# EAGLE design basic-thermometer-SD (EAGLE 7.2.0)
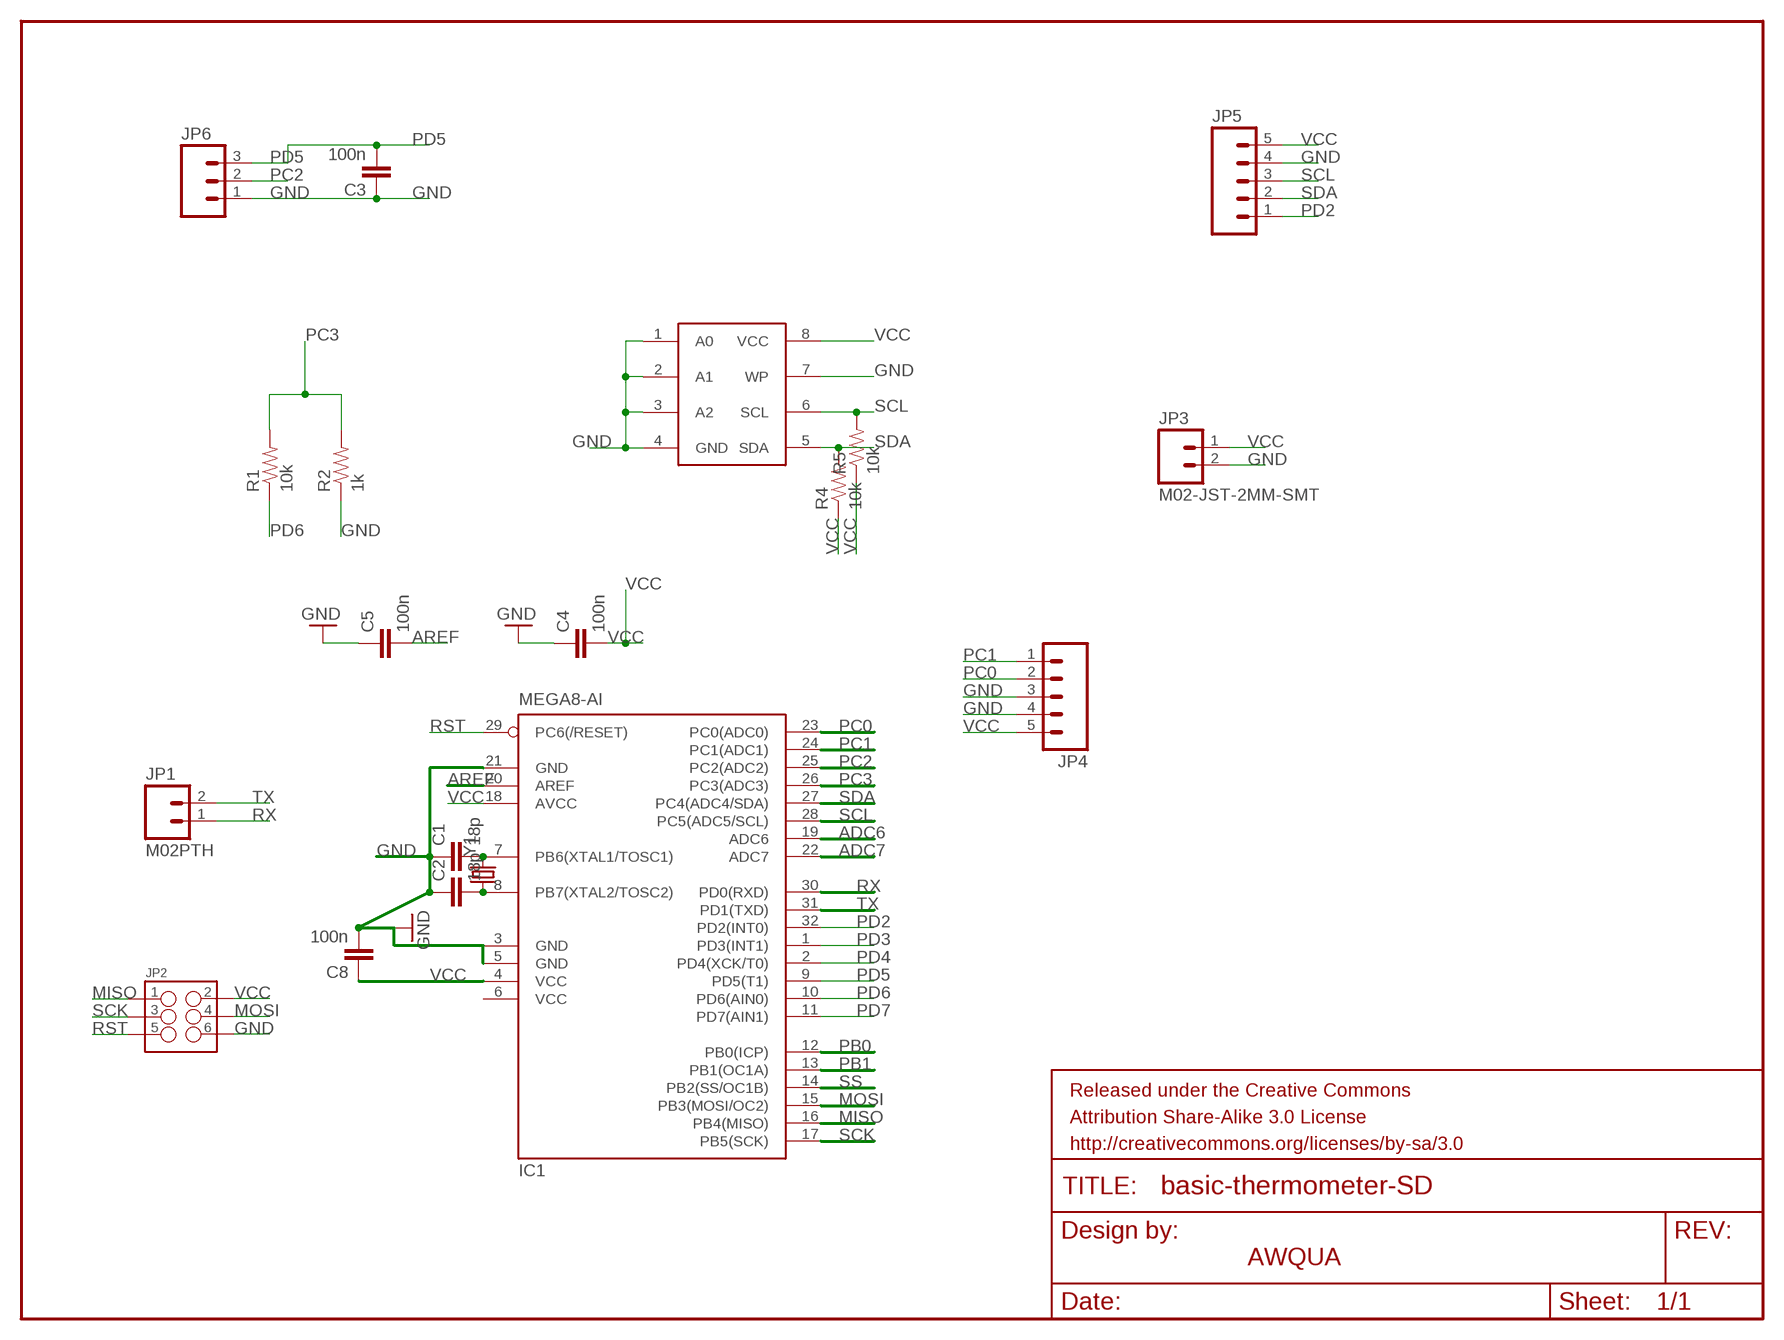
[diagram p0: schematic, sheet 1]

## Parts
C1  18p  CAP0603-CAP  [0603-CAP]
C2  18p  CAP0603-CAP  [0603-CAP]
C3  100n  CAP0603-CAP  [0603-CAP]
C4  100n  CAP0603-CAP  [0603-CAP]
C5  100n  CAP0603-CAP  [0603-CAP]
C8  100n  CAP0603-CAP  [0603-CAP]
EEPROM  AT24C256  [SOIC8-LONGPAD]
FRAME1  FRAME-LETTER  [CREATIVE_COMMONS]
IC1  MEGA8-AI  [TQFP32-08]
JP1  M02PTH  [1X02]
JP2  M03X22X3_SILK_SM  [2X3]
JP3  M02-JST-2MM-SMT  [JST-2-SMD]
JP4  M05PTH  [1X05]
JP5  M05PTH  [1X05]
JP6  M03PTH  [1X03]
R1  10k  RESISTOR0603  [0603-RES]
R2  1k  RESISTOR0603  [0603-RES]
R4  10k  RESISTOR0603  [0603-RES]
R5  10k  RESISTOR0603  [0603-RES]
Y1  CRYSTAL5X3  [CRYSTAL-SMD-5X3]

## Nets
ADC6: IC1.19(ADC6)
ADC7: IC1.22(ADC7)
AREF: C5.2 IC1.20(AREF)
GND: C1.1 C2.1 C3.1 C4.1 C5.1 C8.2 EEPROM.1(A0) EEPROM.2(A1) EEPROM.3(A2) EEPROM.4(GND) EEPROM.7(WP) IC1.3(GND) IC1.5(GND) IC1.21(GND) JP2.6 JP3.2 JP4.3 JP4.4 JP5.4 JP6.1 R2.1
MISO: IC1.16(PB4(MISO)) JP2.1
MOSI: IC1.15(PB3(MOSI/OC2)) JP2.4
PB0: IC1.12(PB0(ICP))
PB1: IC1.13(PB1(OC1A))
PC0: IC1.23(PC0(ADC0)) JP4.2
PC1: IC1.24(PC1(ADC1)) JP4.1
PC2: IC1.25(PC2(ADC2)) JP6.2
PC3: IC1.26(PC3(ADC3)) R1.2 R2.2
PD2: IC1.32(PD2(INT0)) JP5.1
PD3: IC1.1(PD3(INT1))
PD4: IC1.2(PD4(XCK/T0))
PD5: C3.2 IC1.9(PD5(T1)) JP6.3
PD6: IC1.10(PD6(AIN0)) R1.1
PD7: IC1.11(PD7(AIN1))
Q1: C2.2 IC1.8(PB7(XTAL2/TOSC2)) Y1.1
Q2: C1.2 IC1.7(PB6(XTAL1/TOSC1)) Y1.3
RST: IC1.29(PC6(/RESET)) JP2.5
RX: IC1.30(PD0(RXD)) JP1.1
SCK: IC1.17(PB5(SCK)) JP2.3
SCL: EEPROM.6(SCL) IC1.28(PC5(ADC5/SCL)) JP5.3 R5.2
SDA: EEPROM.5(SDA) IC1.27(PC4(ADC4/SDA)) JP5.2 R4.2
SS: IC1.14(PB2(SS/OC1B))
TX: IC1.31(PD1(TXD)) JP1.2
VCC: C4.2 C8.1 EEPROM.8(VCC) IC1.4(VCC) IC1.18(AVCC) JP2.2 JP3.1 JP4.5 JP5.5 R4.1 R5.1

## Notes on the sheet
- AWQUA

## Power pins joined to a net without a drawn wire
VCC: IC1.6(VCC)

## Library data of the parts
C1-C5 C8 = SparkFun:CAP: Capacitor Standard 0603 ceramic capacitor, and 0.1" leaded capacitor.
EEPROM = open_source_turbidimeter:AT24C256
FRAME1 = SparkFun-Aesthetics:FRAME-LETTER: Schematic Frame Standard 8.5x11 US Letter frame
IC1 = atmel:MEGA8: MICROCONTROLLER 8 Kbytes FLASH, 1 kbytes SRAM, 512 bytes EEPROM, USART, 6-channel 10 bit ADC, 2-channel 8 bit ADC Pin compatible with Atmega48, ATMega88, ATMega168 Source: avr.lbr; MPN: ATMEGA8-16AU; OC_FARNELL: 9171371; OC_NEWARK: 73M8863
JP1 = SparkFun-Connectors:M02: Standard 2-pin 0.1" header. Use with - straight break away headers ( PRT-00116) - right angle break away headers (PRT-00553) - swiss pins (PRT-00743) - machine pins (PRT-00117) - female headers (PRT-00115) Molex polarized connector foot print use with: PRT-08233 with associated crimp pins and housings. 2.54_SCREWTERM for use with PRT-10571. 3.5mm Screw Terminal footprints for PRT-08084 5mm Screw Terminal footprints for use with PRT-08433
JP2 = SparkFun-Connectors:M03X2: 2x3 .1" header. Shrouded, with keying- CONN-10681 SMT- CONN-11415 Pogo pins- HW-11044
JP3 = SparkFun-Connectors:M02: Standard 2-pin 0.1" header. Use with - straight break away headers ( PRT-00116) - right angle break away headers (PRT-00553) - swiss pins (PRT-00743) - machine pins (PRT-00117) - female headers (PRT-00115) Molex polarized connector foot print use with: PRT-08233 with associated crimp pins and housings. 2.54_SCREWTERM for use with PRT-10571. 3.5mm Screw Terminal footprints for PRT-08084 5mm Screw Terminal footprints for use with PRT-08433; PROD_ID: CONN-08352
JP4 JP5 = SparkFun-Connectors:M05: Header 5 Standard 5-pin 0.1" header. Use with straight break away headers (SKU : PRT-00116), right angle break away headers (PRT-00553), swiss pins (PRT-00743), machine pins (PRT-00117), and female headers (PRT-00115). Molex polarized connector foot print use with SKU : PRT-08230 with associated crimp pins and housings.
JP6 = SparkFun-Connectors:M03: Header 3 Standard 3-pin 0.1" header. Use with straight break away headers (SKU : PRT-00116), right angle break away headers (PRT-00553), swiss pins (PRT-00743), machine pins (PRT-00117), and female headers (PRT-00115). Molex polarized connector foot print use with SKU : PRT-08232 with associated crimp pins and housings.
R1 R2 R4 R5 = SparkFun-Resistors:RESISTOR: Resistor Basic schematic elements and footprints for 0603, 1206, and PTH resistors.
Y1 = SparkFun:CRYSTAL: Crystals Various standard crystals. Proven footprints. Spark Fun Electronics SKU : COM-00534

## Board
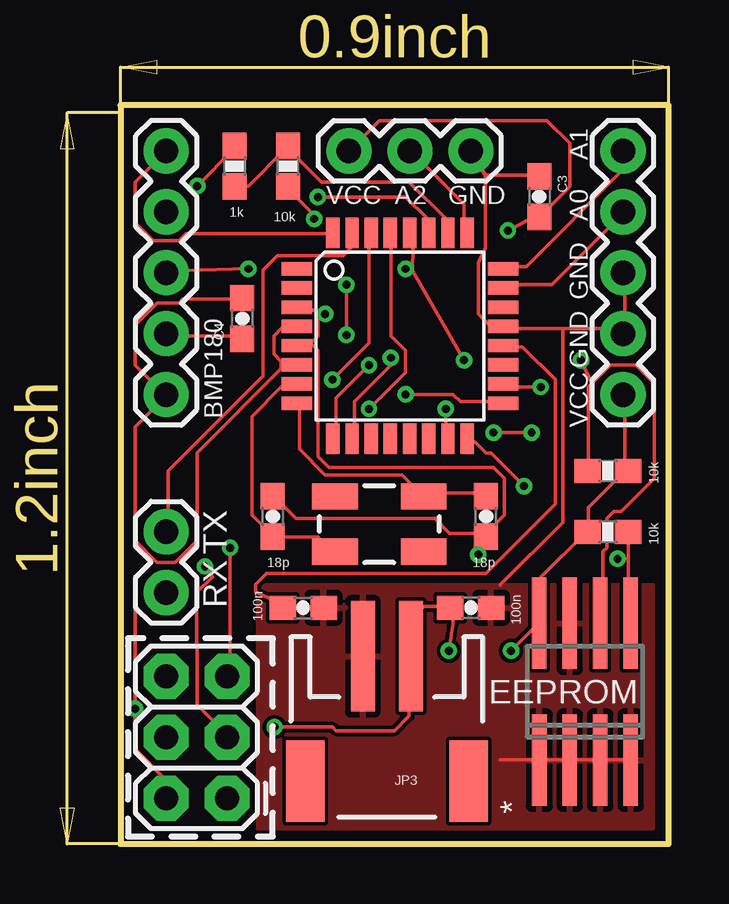
[diagram p1: board, top side]
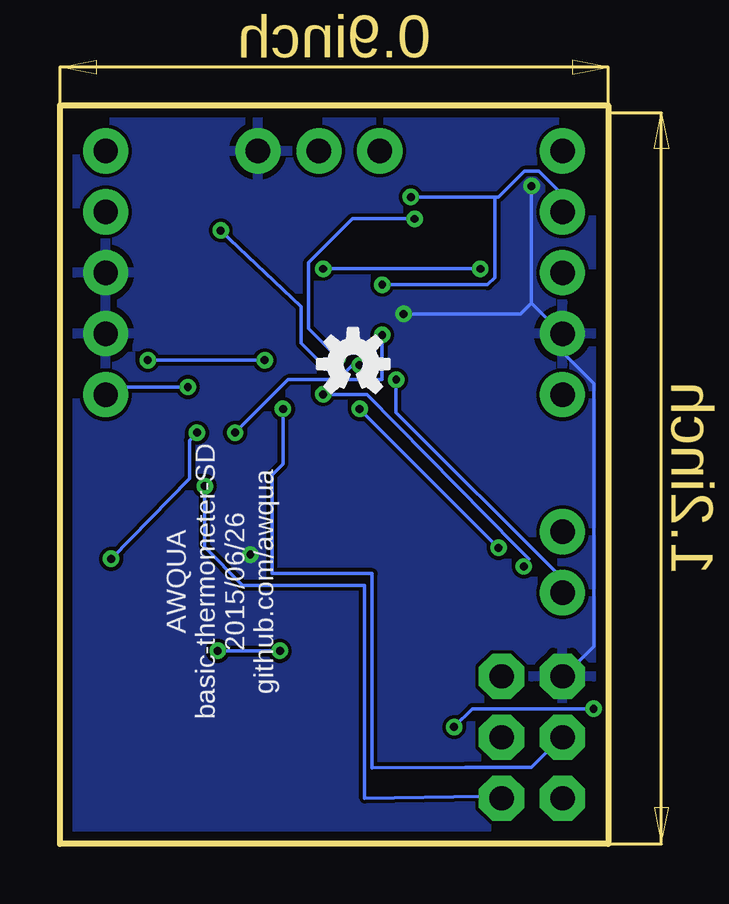
[diagram p2: board, bottom side, seen from below]

Size 22.86 x 30.8 mm. Coordinates in mm from the lower left corner, seen from the top.
Outline: 0,0 22.86,0 22.86,30.8 0,30.8 0,0
Copper layers (1*16): Top 0.0356mm / dielectric 1.5011mm / Bottom 0.0356mm
Design rules "default *": minimum track width 6mil, minimum drill 13mil, track to track 6mil, track to pad 6mil, pad to pad 6mil, via to via 6mil, smd to smd 6mil, copper to edge 15mil, drill to drill 6mil, minimum pad ring 7mil, minimum via ring 7mil, stop-mask expansion 4mil, vias tented up to drill 15mil, thermal gap 10mil

### Footprints (pad centres in the part's own frame; a part is rotated, then mirrored left to right if it is on the bottom)
0603-CAP = smd 1.1 x 1: 1 -0.85,0; 2 0.85,0
SOIC8-LONGPAD = smd 3.81 x 0.635: 1 -0.314,5.715 | smd 3.81 x 0.6: 2 -0.314,4.445; 3 -0.314,3.175; 4 -0.314,1.905; 5 5.394,1.905; 6 5.394,3.175; 7 5.394,4.445; 8 5.394,5.715
TQFP32-08 = smd 1.27 x 0.559: 1 -4.293,2.8; 2 -4.293,2; 3 -4.293,1.2; 4 -4.293,0.4; 5 -4.293,-0.4; 6 -4.293,-1.2; 7 -4.293,-2; 8 -4.293,-2.8; 17 4.293,-2.8; 18 4.293,-2; 19 4.293,-1.2; 20 4.293,-0.4; 21 4.293,0.4; 22 4.293,1.2; 23 4.293,2; 24 4.293,2.8 | smd 0.559 x 1.27: 9 -2.8,-4.293; 10 -2,-4.293; 11 -1.2,-4.293; 12 -0.4,-4.293; 13 0.4,-4.293; 14 1.2,-4.293; 15 2,-4.293; 16 2.8,-4.293; 25 2.8,4.293; 26 2,4.293; 27 1.2,4.293; 28 0.4,4.293; 29 -0.4,4.293; 30 -1.2,4.293; 31 -2,4.293; 32 -2.8,4.293
1X02 = drill 1.016 pad 1.88: 1 0,0; 2 2.54,0
2X3 = drill 1.016 pad 1.88 octagon: 1 0,0; 2 0,2.54; 3 2.54,0; 4 2.54,2.54; 5 5.08,0; 6 5.08,2.54
JST-2-SMD = smd 1 x 4.6: 1 -1,-3.7; 2 1,-3.7 | smd 1.6 x 3.4: NC1 -3.4,1.5; NC2 3.4,1.5
1X05 = drill 1.016 pad 1.88: 1 0,0; 2 2.54,0; 3 5.08,0; 4 7.62,0; 5 10.16,0
1X03 = drill 1.016 pad 1.88: 1 0,0; 2 2.54,0; 3 5.08,0
0603-RES = smd 1.1 x 1: 1 -0.85,0; 2 0.85,0
CRYSTAL-SMD-5X3 = smd 1.9 x 1.1: 1 -1.85,-1.15; 2 1.85,-1.15; 3 1.85,1.15; 4 -1.85,1.15

### Placement (x,y rotation side)
C1  6.35,13.65 270 top
C2  15.24,13.65 90 top
C3  17.46,26.99 270 top
C4  5.08,21.91 90 top
C5  7.62,9.84 180 top
C8  14.61,9.84 0 top
EEPROM  23.18,3.81 90 top
FRAME1  20.95,-7.62 0 top  (outside the outline)
IC1  11.65,21.18 0 top
JP1  1.91,10.48 90 top
JP2  4.45,1.91 90 top
JP3  11.11,4.13 180 top
JP4  20.95,28.89 270 top
JP5  1.91,28.89 270 top
JP6  14.61,28.89 180 top
R1  6.99,28.26 90 top
R2  4.76,28.26 270 top
R4  20.32,13.02 0 top
R5  20.32,15.56 180 top
U$1  [OSHW-LOGO-S]  10.64,20 0 bottom
Y1  10.79,13.34 180 top

### Tracks (layer width: path | path; a pad name or v marks a point on that pad's centre or on a via)
AREF
  Top 0.152: C5.2 6.71,9.91 6.4,10.21 6.25,10.21 5.63,10.52 5.63,10.82 6.08,11.28 15.24,11.28 18.14,14.17 18.14,19.36 16.76,20.73 16,20.73 IC1.20
GND  (via drill 0.33)
  Top 0.152: 15.23,27.89 17.37,27.89 C3.1 | 15.23,27.89 14.63,28.8 JP6.1 | 18.44,21.49 20.73,21.49 20.88,21.34 JP4.4 21.03,21.34 21.03,23.77 JP4.3 | 18.44,21.49 16,21.49 IC1.21 15.85,21.64 15.39,21.64 14.94,22.1 14.94,24.23 15.23,24.84 15.23,27.89 | 7.92,20.88 7.47,20.88 IC1.5 7.92,20.88 | 7.92,20.88 8.23,21.18 8.23,22.1 | 8.23,22.1 8.08,22.25 7.47,22.25 IC1.3 | 15.24,12.95 13.72,12.95 13.11,13.56 7.32,13.56 6.4,14.48 C1.1 | 7.92,20.88 8.23,20.57 8.23,16.15 8.69,15.7 15.54,15.7 16,15.24 16,13.72 15.24,12.95 | 15.24,12.95 C2.1 v14.92,12.06 | C4.1 5.03,21.18 1.98,21.18 JP5.4 | v3.2,27.43 4.72,28.96 R2.1 | EEPROM.4 21.18,3.5 20.12,3.5 EEPROM.3 19.96,3.5 18.75,3.5 EEPROM.2 18.59,3.5 17.53,3.5 EEPROM.1 17.37,3.5 15.85,3.5 | v8.53,22.1 8.23,22.1 | 18.44,21.49 18.44,13.41 15.85,10.82 15.85,10.79
  Bottom 0.152: 3.2,22.55 v3.2,27.43 | 3.2,22.55 1.98,21.34 JP5.4 1.83,21.18 1.83,20.42 0.61,19.2 0.61,8.23 1.83,7.01 JP2.6 | v8.53,22.1 3.66,22.1 3.2,22.55 | v14.92,12.06 14.92,11.75
  pour Top: 5.71,10.79 22.23,10.79 22.23,0.64 5.71,0.64
  pour Bottom: 0,31.11 22.86,31.11 22.86,0 0,0
  pour Bottom: 0,31.11 22.86,31.11 22.86,0 0,0
MISO  (via drill 0.33)
  Top 0.152: v16.83,14.92 15.44,16.31 15.24,16.31 14.78,16.76 14.48,16.76 IC1.16
  Bottom 0.152: v16.83,14.92 16.83,12.38 15.24,10.77 10.16,10.77 10.16,1.91 5.18,1.98 4.57,1.98 JP2.1
MOSI  (via drill 0.33)
  Top 0.152: v13.56,18.14 13.56,16.92 IC1.15
  Bottom 0.152: v13.56,18.14 13.56,15.85 14.02,15.39 14.02,11.28 9.84,11.28 9.84,3.17 5.94,3.2 3.2,3.2 1.98,4.42 JP2.4
PC0
  Top 0.152: IC1.23 16,23.32 17.98,23.32 20.88,26.21 JP4.2
PC1
  Top 0.152: IC1.24 16,24.08 16.92,24.08 20.88,28.04 20.88,28.8 JP4.1
PC2
  Top 0.152: IC1.25 14.33,25.6 14.33,26.67 12.19,28.8 JP6.2
PC3
  Top 0.152: R2.2 4.88,27.43 5.33,27.43 6.86,28.96 R1.2 7.01,28.96 8.38,27.58 12.04,27.58 13.56,26.06 13.56,25.6 IC1.26
PD2
  Top 0.152: IC1.32 8.84,25.45 2.74,25.45 2.44,25.15 1.37,25.15 0.61,25.91 0.61,27.58 1.83,28.8 JP5.1
PD5  (via drill 0.33)
  Top 0.152: v16.15,25.58 17.37,26.21 C3.2 18.73,27.41 18.73,29.21 17.78,30.16 10.79,30.16 JP6.3 | v10.36,19.96 8.99,18.59 8.99,16.92 IC1.9
  Bottom 0.152: v16.15,25.58 12.8,22.4 12.8,20.88 11.58,19.66 10.97,19.66 10.67,19.96 v10.36,19.96
PD6  (via drill 0.33)
  Top 0.152: v8.08,26.06 8.08,26.21 7.01,27.28 R1.1 | v11.28,20.27 11.28,19.96 9.75,18.44 9.75,16.92 IC1.10
  Bottom 0.152: v8.08,26.06 10.67,26.06 12.5,24.23 12.5,21.49 v11.28,20.27
Q1
  Top 0.152: C2.2 15.24,14.63 12.65,14.63 Y1.1 12.5,14.63 11.73,15.39 8.53,15.39 7.47,16.46 7.47,18.29 IC1.8
Q2
  Top 0.152: Y1.3 8.84,12.19 8.23,12.8 6.4,12.8 C1.2 6.25,12.95 5.49,13.72 5.49,17.83 6.71,19.05 7.32,19.05 IC1.7
RST  (via drill 0.33)
  Top 0.152: v10.36,18.14 11.89,19.66 11.89,20.57 11.28,21.18 11.28,25.45 IC1.29 | v4.57,12.34 4.57,7.01 JP2.5
  Bottom 0.152: v4.57,12.34 v10.36,18.14
RX  (via drill 0.33)
  Top 0.152: v8.84,19.36 10.36,20.88 10.36,25.45 IC1.30
  Bottom 0.152: v8.84,19.36 8.84,17.98 1.98,11.12 1.98,10.52 JP1.1
SCK  (via drill 0.33)
  Top 0.152: v11.89,18.75 13.87,18.75 14.17,18.44 15.85,18.44 IC1.17 | v3.52,11.57 3.83,11.14 3.17,10.48 3.2,5.79 4.42,4.57 JP2.3
  Bottom 0.152: v11.89,18.75 10.06,18.75 3.81,12.38 3.31,11.89 v3.52,11.57
SCL  (via drill 0.33)
  Top 0.152: 19.66,19.2 20.42,19.96 21.49,19.96 22.25,19.2 22.25,15.24 20.88,13.87 20.57,13.87 20.27,13.56 20.27,12.34 20.12,12.19 20.12,9.3 EEPROM.6 | 19.66,19.2 19.51,19.05 19.51,15.7 R5.2 | v14.33,20.17 12.18,23.9 | 12.18,23.9 12.19,24.84 12.19,25.45 IC1.28 | 19.66,19.2 v19.2,20.17 | v5.33,23.98 1.98,23.88 JP5.3 | 12.18,23.9 v11.89,23.98
  Bottom 0.152: v19.2,20.17 v14.33,20.17 | v11.89,23.98 v5.33,23.98
SDA  (via drill 0.33)
  Top 0.152: 21.18,11.89 21.18,9.3 EEPROM.5 | 21.18,11.89 21.18,12.95 R4.2 | v8.23,26.98 11.89,26.98 12.8,26.06 12.8,25.6 IC1.27 | v20.73,11.89 21.18,11.89 | v15.56,17.14 v17.14,17.14 | v9.42,23.32 v9.42,21.22
  Bottom 0.152: 4.72,26.98 4.57,26.98 3.5,28.04 2.9,28.04 1.98,27.13 1.98,26.36 JP5.2 | 4.72,26.98 v8.23,26.98 | v15.56,17.14 13.35,19.36 9.42,19.36 v9.42,21.22 | v17.14,17.14 17.46,16.83 17.46,15.24 v20.73,11.89 | v9.42,23.32 5.03,23.32 4.72,23.62 4.72,26.98
TX
  Top 0.152: IC1.31 9.6,25.45 9.6,24.84 9.3,24.54 6.55,24.54 5.94,23.93 5.94,19.51 1.98,15.54 1.98,13.11 JP1.2
VCC  (via drill 0.33)
  Top 0.152: v17.53,19.05 16,19.05 IC1.18 | JP4.5 21.03,18.59 21.03,15.7 R5.1 21.03,15.54 19.51,14.02 19.51,13.11 R4.1 19.36,12.95 17.53,11.12 17.53,9.3 EEPROM.8 17.37,9.14 v16.28,8.05 | v13.69,8.05 13.87,9.14 13.87,9.75 C8.1 13.72,9.91 12.65,9.91 12.19,9.45 12.19,7.92 JP3.1 12.04,7.77 12.04,5.33 11.43,4.72 8.99,4.72 8.84,4.88 v6.43,4.88 | 6.71,20.12 7.32,20.12 IC1.6 | 6.71,20.12 6.4,20.42 6.4,21.18 6.71,21.49 7.32,21.49 IC1.4 | C4.2 5.03,22.71 2.59,22.71 2.44,22.55 1.52,22.55 0.61,21.64 0.61,19.96 1.83,18.75 JP5.5 1.83,18.59 0.61,17.37 0.61,12.65 1.37,11.89 | 6.71,20.12 6.71,19.81 3.2,16.31 3.2,12.65 2.29,11.73 1.52,11.73 1.37,11.89 | 1.37,11.89 0.61,11.12 v0.61,5.64 0.61,3.96 1.83,2.74 1.83,1.98 JP2.2
  Bottom 0.152: v17.53,19.05 20.57,19.05 20.88,18.75 JP4.5 | v16.28,8.05 v13.69,8.05 | v6.43,4.88 5.66,5.64 v0.61,5.64

### Text on the board
bPlace: AWQUA / basic-thermometer-SD / 2015/06/26 / github.com/awqua
tNames: A1 | VCC | A2 | GND | A0 | GND | BMP180 | GND | VCC | TX | RX | *